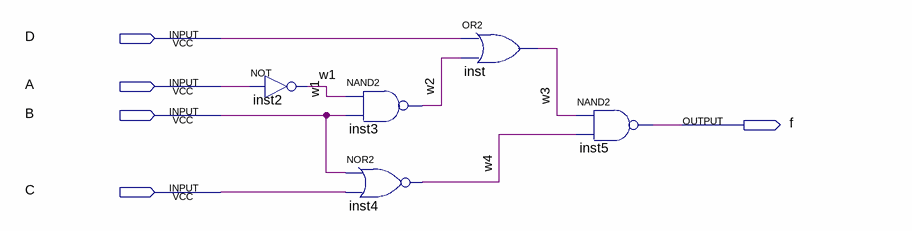
[diagram p0: schematic sheet]
// Quartus schematic Lab_1_Section_1.bdf as structural Verilog: 5 symbols, 5 pins
module Lab_1_Section_1 (
  input  D,
  input  A,
  input  B,
  input  C,
  output f
);

  wire w1, w2, w3, w4;

  not inst2 (w1, A);
  nand inst3 (w2, w1, B);
  nor inst4 (w4, B, C);
  or inst (w3, D, w2);
  nand inst5 (f, w3, w4);
endmodule
